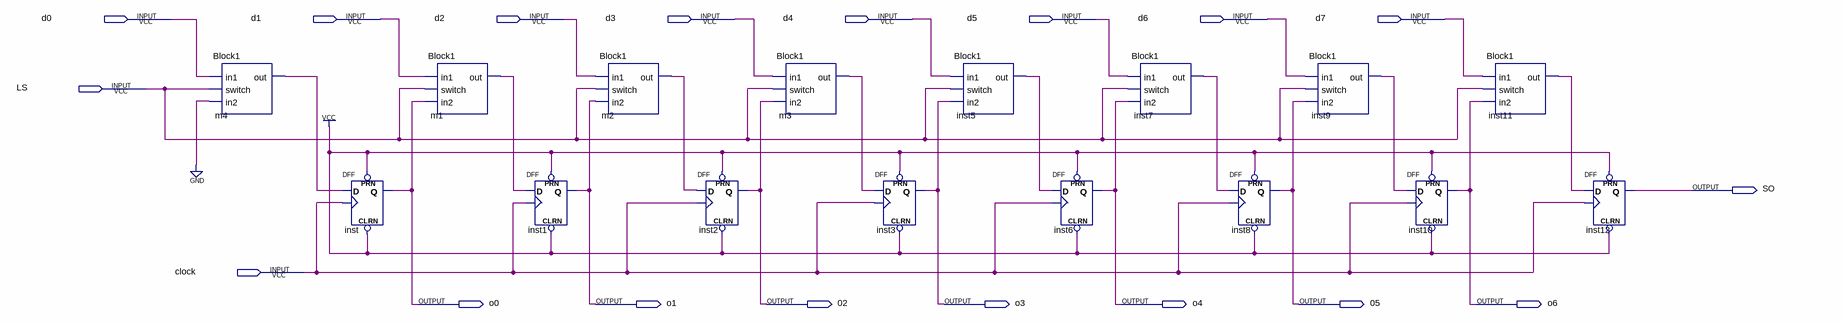
[diagram p0: schematic sheet]
// Quartus schematic PISOconverter.bdf as structural Verilog: 16 symbols, 18 pins
module PISOconverter (
  input  d0,
  input  d1,
  input  d2,
  input  d3,
  input  d4,
  input  d5,
  input  d6,
  input  d7,
  input  LS,
  input  clock,
  output SO,
  output o0,
  output o1,
  output \02 ,
  output o3,
  output o4,
  output \05 ,
  output o6
);

  wire inst5_out, inst7_out, inst9_out, inst11_out, m1_out, m2_out, m3_out, m4_out;

  Block1 m4 (.in1(d0), .switch(LS), .in2(1'b0), .out(m4_out));
  DFF inst (.CLRN(1'b1), .CLK(clock), .D(m4_out), .PRN(1'b1), .Q(o0));
  Block1 m1 (.in1(d1), .switch(LS), .in2(o0), .out(m1_out));
  DFF inst1 (.CLRN(1'b1), .CLK(clock), .D(m1_out), .PRN(1'b1), .Q(o1));
  Block1 m2 (.in1(d2), .switch(LS), .in2(o1), .out(m2_out));
  DFF inst2 (.CLRN(1'b1), .CLK(clock), .D(m2_out), .PRN(1'b1), .Q(\02 ));
  Block1 m3 (.in1(d3), .switch(LS), .in2(\02 ), .out(m3_out));
  DFF inst3 (.CLRN(1'b1), .CLK(clock), .D(m3_out), .PRN(1'b1), .Q(o3));
  Block1 inst5 (.in1(d4), .switch(LS), .in2(o3), .out(inst5_out));
  DFF inst6 (.CLRN(1'b1), .CLK(clock), .D(inst5_out), .PRN(1'b1), .Q(o4));
  Block1 inst7 (.in1(d5), .switch(LS), .in2(o4), .out(inst7_out));
  DFF inst8 (.CLRN(1'b1), .CLK(clock), .D(inst7_out), .PRN(1'b1), .Q(\05 ));
  Block1 inst9 (.in1(d6), .switch(LS), .in2(\05 ), .out(inst9_out));
  DFF inst10 (.CLRN(1'b1), .CLK(clock), .D(inst9_out), .PRN(1'b1), .Q(o6));
  Block1 inst11 (.in1(d7), .switch(LS), .in2(o6), .out(inst11_out));
  DFF inst12 (.CLRN(1'b1), .CLK(clock), .D(inst11_out), .PRN(1'b1), .Q(SO));
endmodule
